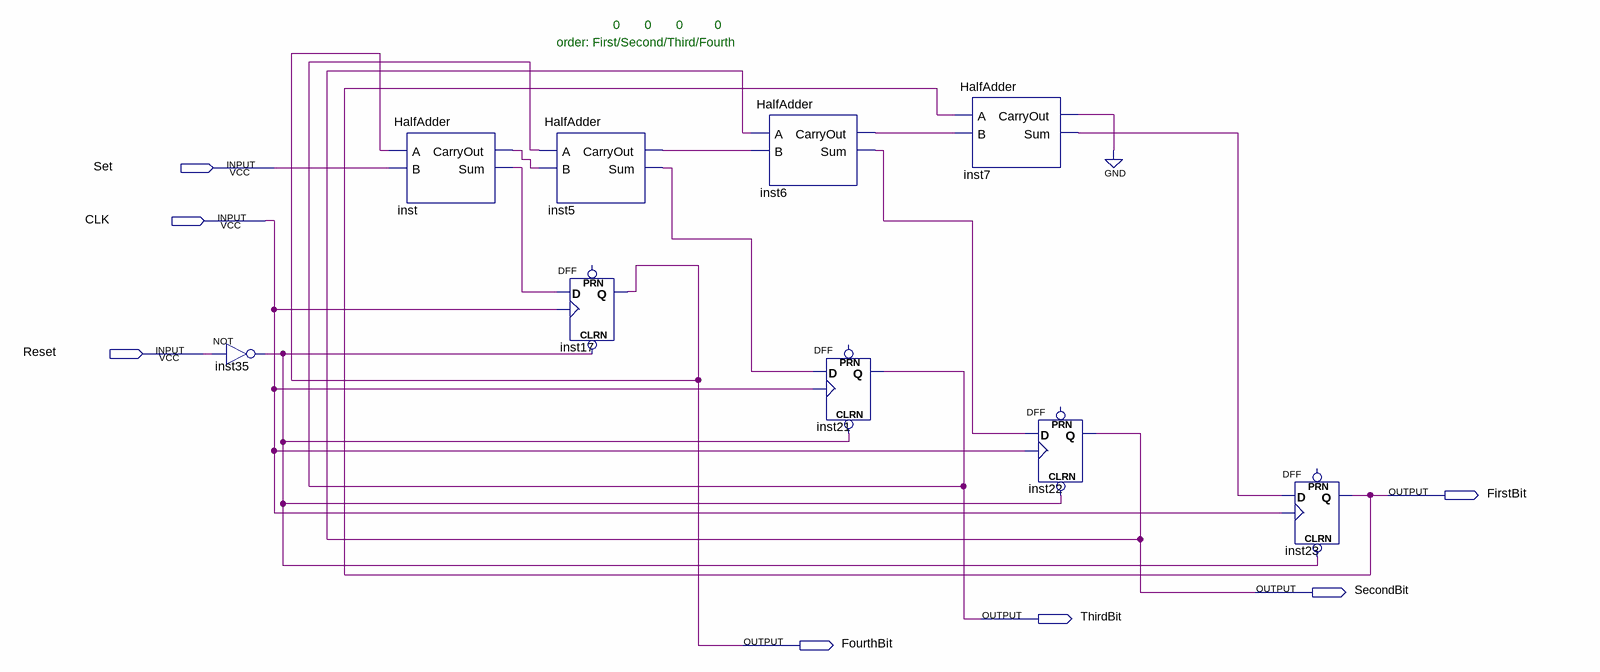
[diagram p0: schematic sheet]
// Quartus schematic RPMSetter.bdf as structural Verilog: 9 symbols, 7 pins
module RPMSetter (
  input  Set,
  input  CLK,
  input  Reset,
  output FirstBit,
  output SecondBit,
  output ThirdBit,
  output FourthBit
);

  wire inst5_carryout, inst5_sum, inst6_carryout, inst6_sum, inst7_carryout, inst7_sum, inst35_out,
       inst_carryout, inst_sum;

  not inst35 (inst35_out, Reset);
  HalfAdder inst (.A(FourthBit), .B(Set), .CarryOut(inst_carryout), .Sum(inst_sum));
  HalfAdder inst5 (.A(ThirdBit), .B(inst_carryout), .CarryOut(inst5_carryout), .Sum(inst5_sum));
  DFF inst17 (.CLRN(inst35_out), .CLK(CLK), .D(inst_sum), .Q(FourthBit));  // open: PRN
  HalfAdder inst6 (.A(SecondBit), .B(inst5_carryout), .CarryOut(inst6_carryout), .Sum(inst6_sum));
  DFF inst21 (.CLRN(inst35_out), .CLK(CLK), .D(inst5_sum), .Q(ThirdBit));  // open: PRN
  HalfAdder inst7 (.A(FirstBit), .B(inst6_carryout), .CarryOut(inst7_carryout), .Sum(inst7_sum));
  DFF inst22 (.CLRN(inst35_out), .CLK(CLK), .D(inst6_sum), .Q(SecondBit));  // open: PRN
  DFF inst23 (.CLRN(inst35_out), .CLK(CLK), .D(inst7_sum), .Q(FirstBit));  // open: PRN
  // also tied to GND on the sheet: inst7_carryout

  // Notes on the sheet:
  //    0       0       0         0    
  //   order: First/Second/Third/Fourth  
endmodule
